# EAGLE design Modellfinder (EAGLE 7.6.0)
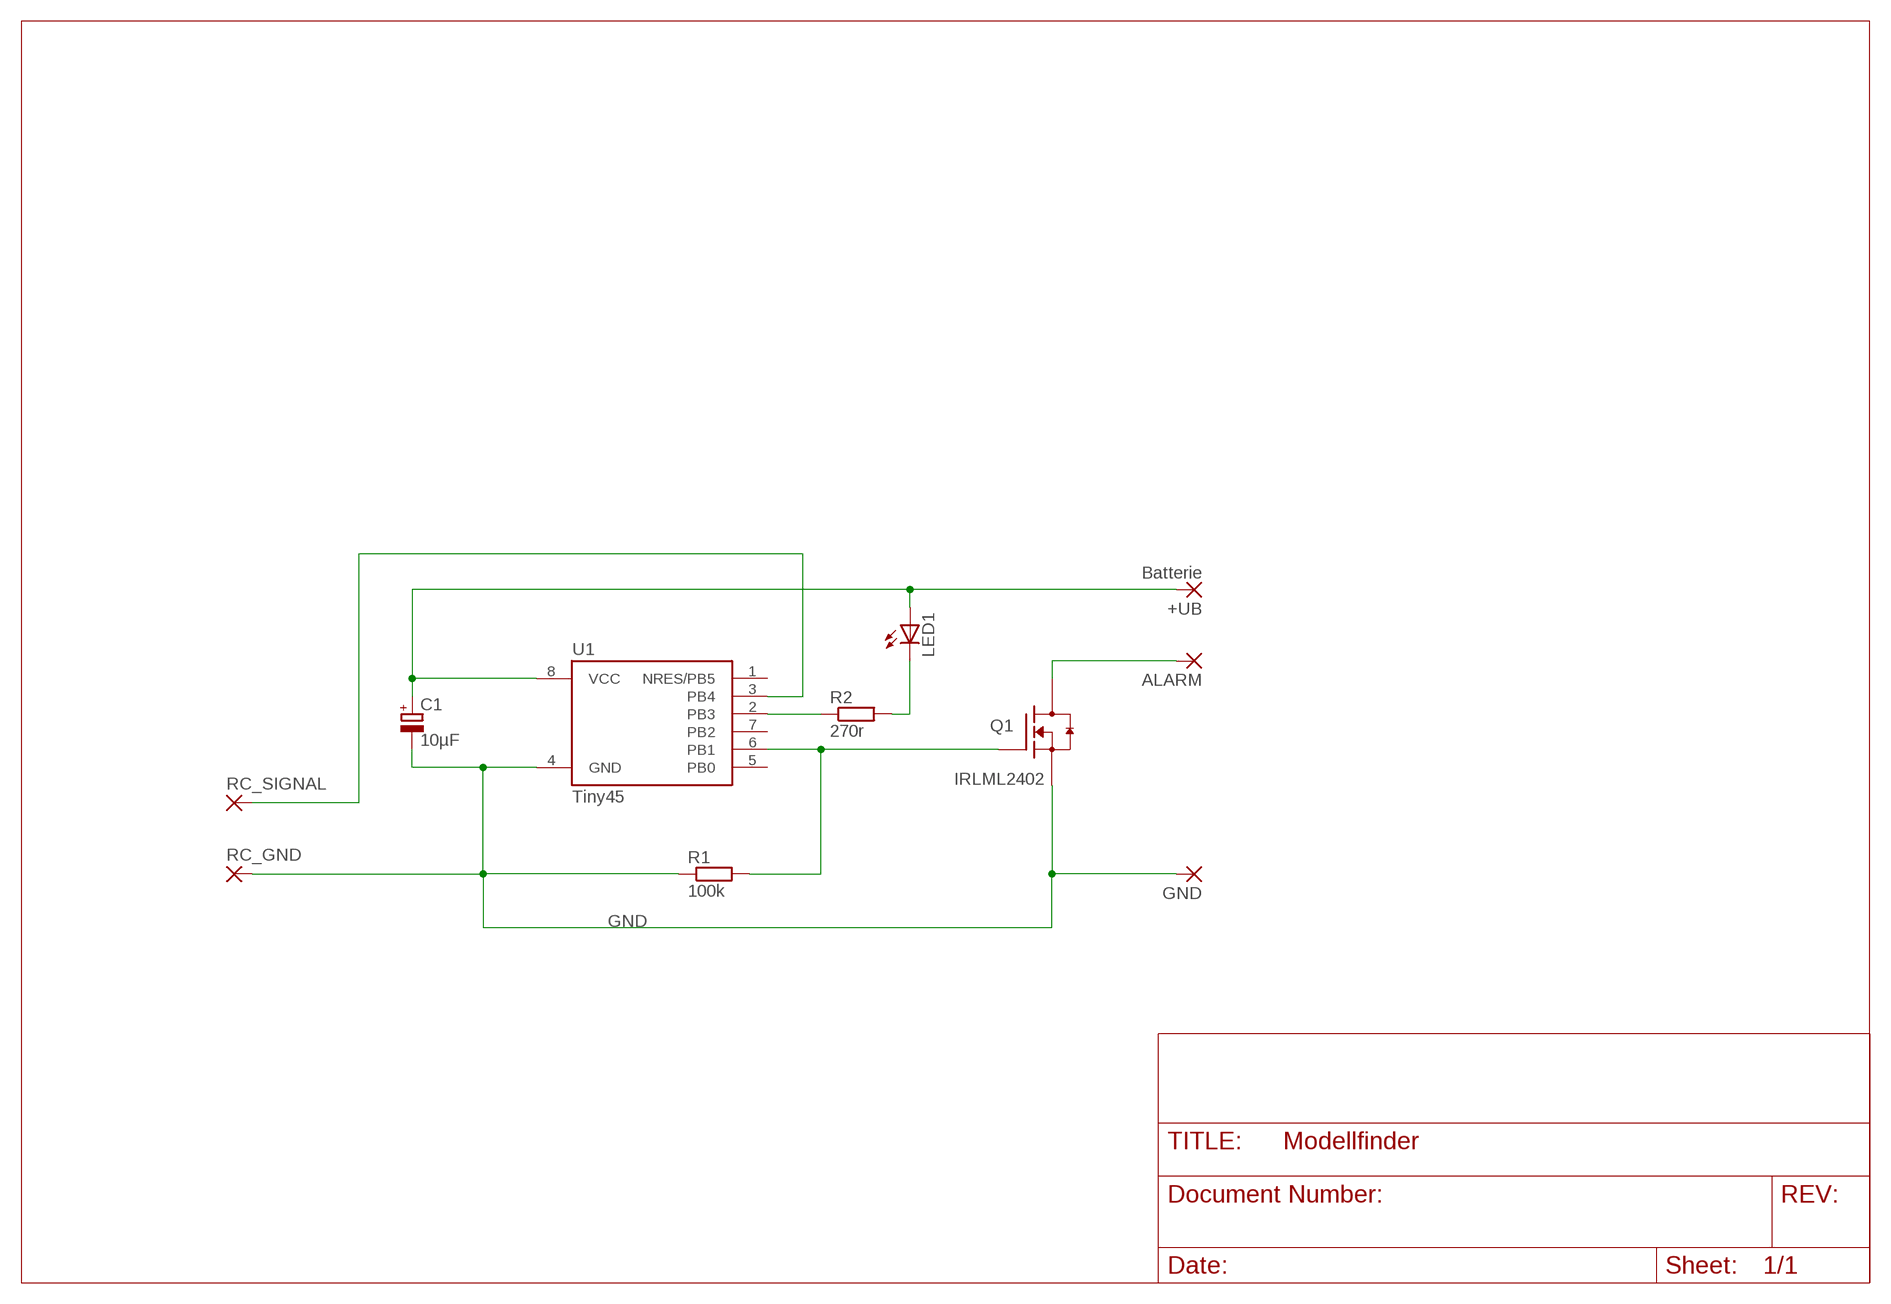
[diagram p0: schematic, sheet 1]

## Parts
+UB  Batterie  SMD2  [SMD1,27-2,54]
ALARM  SMD2  [SMD1,27-2,54]
C1  10µF  CPOL-EU085CS-1AR  [085CS_1AR]
GND  SMD2  [SMD1,27-2,54]
LED1  LEDSML0805  [SML0805]
Q1  IRLML2402  MOSFET-NCH_SOT-23  [SOT95P280X135-3N]
R1  100k  R-EU_M1206  [M1206]
R2  270r  R-EU_M1206  [M1206]
RC_GND  SMD2  [SMD1,27-2,54]
RC_SIGNAL  SMD2  [SMD1,27-2,54]
U1  Tiny45  ATTINY85-S  [SOIC8_EIAJ_208MIL]

## Nets
GND: C1.- GND.1(P) Q1.2(S) R1.1 RC_GND.1(P) U1.4(GND)
N$1: Q1.1(G) R1.2 U1.6(PB1)
N$2: LED1.C R2.2
N$3: +UB.1(P) C1.+ LED1.A U1.8(VCC)
N$4: ALARM.1(P) Q1.3(D)
N$5: RC_SIGNAL.1(P) U1.3(PB4)
N$6: R2.1 U1.2(PB3)
Unconnected: U1.1(NRES/PB5) U1.5(PB0) U1.7(PB2)

## Library data of the parts
+UB ALARM GND RC_GND RC_SIGNAL = wirepad:SMD2: SMD PAD
C1 = rcl:CPOL-EU: POLARIZED CAPACITOR, European symbol
LED1 = led:LED: LED OSRAM: - CHIPLED LG R971, LG N971, LY N971, LG Q971, LY Q971, LO R971, LY R971 LH N974, LH R974 LS Q976, LO Q976, LY Q976 LO Q996 - Hyper CHIPLED LW Q18S LB Q993, LB Q99A, LB R99A - SideLED LS A670, LO A670, LY A670, LG A670, LP A670 LB A673, LV A673, LT A673, LW A673 LH A674 LY A675 LS A676, LA A676, LO A676, LY A676, LW A676 LS A679, LY A679, LG A679 - Hyper Micro SIDELED® LS Y876, LA Y876, LO Y876, LY Y876 LT Y87S - SmartLED LW L88C, LW L88S LB L89C, LB L89S, LG L890 LS L89K, LO L89K, LY L89K LS L896, LA L896, LO L896, LY L896 - TOPLED LS T670, LO T670, LY T670, LG T670, LP T670 LSG T670, LSP T670, LSY T670, LOP T670, LYG T670 LG T671, LOG T671, LSG T671 LB T673, LV T673, LT T673, LW T673 LH T674 LS T676, LA T676, LO T676, LY T676, LB T676, LH T676, LSB T676, LW T676 LB T67C, LV T67C, LT T67C, LS T67K, LO T67K, LY T67K, LW E67C LS E67B, LA E67B, LO E67B, LY E67B, LB E67C, LV E67C, LT E67C LW T67C LS T679, LY T679, LG T679 LS T770, LO T770, LY T770, LG T770, LP T770 LB T773, LV T773, LT T773, LW T773 LH T774 LS E675, LA E675, LY E675, LS T675 LS T776, LA T776, LO T776, LY T776, LB T776 LHGB T686 LT T68C, LB T68C - Hyper Mini TOPLED® LB M676 - Mini TOPLED Santana® LG M470 LS M47K, LO M47K, LY M47K Source: http://www.osram.convergy.de LUXEON: - LUMILED® LXK2-PW12-R00, LXK2-PW12-S00, LXK2-PW14-U00, LXK2-PW14-V00 LXK2-PM12-R00, LXK2-PM12-S00, LXK2-PM14-U00 LXK2-PE12-Q00, LXK2-PE12-R00, LXK2-PE12-S00, LXK2-PE14-T00, LXK2-PE14-U00 LXK2-PB12-K00, LXK2-PB12-L00, LXK2-PB12-M00, LXK2-PB14-N00, LXK2-PB14-P00, LXK2-PB14-Q00 LXK2-PR12-L00, LXK2-PR12-M00, LXK2-PR14-Q00, LXK2-PR14-R00 LXK2-PD12-Q00, LXK2-PD12-R00, LXK2-PD12-S00 LXK2-PH12-R00, LXK2-PH12-S00 LXK2-PL12-P00, LXK2-PL12-Q00, LXK2-PL12-R00 Source: www.luxeon.com KINGBRIGHT: KA-3528ASYC Source: www.kingbright.com
Q1 = ipc-7351-transistor:MOSFET-NCH_
R1 R2 = rcl:R-EU_: RESISTOR, European symbol
U1 = _hhn_attiny25_45_85:ATTINY85*: ATMEL ATtiny 85 Packages: P = PDIP 08 30mil S = SOIC 08 EIAJ 208mil Technologies Note: for complete ordering code (temp. range, finish, tape&reel etc.) see www.atmel.com • Supply Voltage: V = (1.8…5.5)V | [blank] = (2.7…5.5)V • Speed: 10 = 10 MHz | 20 = 20 MHz Author: Dipl.-Ing. FH Rainer Bayer HHN Hochschule Heilbronn (Heilbronn University), rainer.bayer@hs-heilbronn.de Ingenieurbüro ing-rb, mail@ing-rb.de

## Net classes
0 default: clearance 0.205 mm

## Board
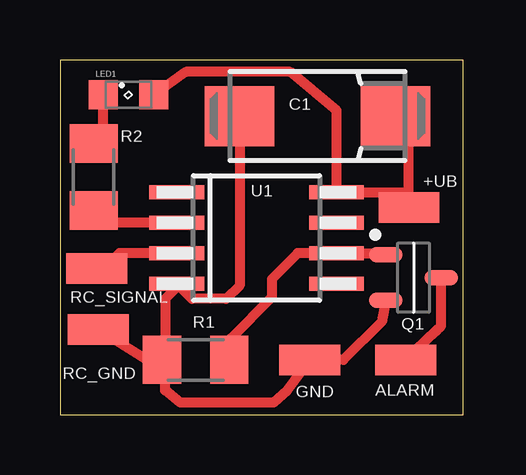
[diagram p1: board, top side]

Size 16.81 x 14.78 mm. Coordinates in mm from the lower left corner, seen from the top.
Outline: 0,0 16.81,0 16.81,14.78 0,14.78 0,0
Copper layers (1*16): Top 0.035mm / dielectric 1.5mm / Bottom 0.035mm
Design rules "Modellfinder": minimum track width 10mil, minimum drill 24mil, track to track 0.205mm, track to pad 0.205mm, pad to pad 0.205mm, via to via 0.205mm, smd to smd 8mil, copper to edge 40mil, drill to drill 8mil, minimum pad ring 10mil, minimum via ring 8mil, stop-mask expansion 4mil, vias tented up to drill 0mil, thermal gap 10mil

### Footprints (pad centres in the part's own frame; a part is rotated, then mirrored left to right if it is on the bottom)
SMD1,27-2,54 = smd 1.27 x 2.54: 1 0,0
085CS_1AR = smd 2.9 x 2.5: + 3.25,0; - -3.25,0
SML0805 = smd 1.2 x 1.2: A 1.05,0; C -1.05,0
SOT95P280X135-3N = smd 1.4 x 0.65: 1 -1.15,0.95; 2 -1.15,-0.95; 3 1.15,0
M1206 = smd 1.6 x 2: 1 -1.4,0; 2 1.4,0
SOIC8_EIAJ_208MIL = smd 0.6 x 2.286: 1 -1.905,-3.33; 2 -0.635,-3.33; 3 0.635,-3.33; 4 1.905,-3.33; 5 1.905,3.33; 6 0.635,3.33; 7 -0.635,3.33; 8 -1.905,3.33

### Placement (x,y rotation side)
+UB  14.54,8.64 90 top
ALARM  14.41,2.29 90 top
C1  10.73,12.45 0 top
GND  10.41,2.29 90 top
LED1  2.86,13.34 0 top
Q1  14.73,5.71 0 top
R1  5.65,2.29 0 top
R2  1.4,9.91 90 top
RC_GND  1.59,3.56 90 top
RC_SIGNAL  1.52,6.1 90 top
U1  8.19,7.37 270 top

### Tracks (layer width: path | path; a pad name or v marks a point on that pad's centre or on a via)
GND
  Top 0.406: C1.- 7.48,5.39 6.92,4.83 5.5,4.83 U1.4 4.86,5.31 4.38,4.83 4.38,2.42 R1.1 | R1.1 3.62,2.29 RC_GND.1 | R1.1 4.38,2.16 4.38,1.02 5.02,0.51 8.89,0.51 9.46,1.02 GND.1 11.81,2.29 13.4,3.88 Q1.2
N$1
  Top 0.406: R1.2 7.11,2.35 7.11,3.17 8.83,4.89 8.83,5.65 9.91,6.73 U1.6 13.58,6.73 Q1.1
N$2
  Top 0.406: R2.2 1.81,11.31 LED1.C
N$3
  Top 0.406: +UB.1 14.54,9.14 | 14.54,9.14 14.54,11.89 C1.+ | 14.54,9.14 14.41,9.27 U1.8 11.52,12.67 9.59,14.29 5.24,14.29 LED1.A
N$4
  Top 0.406: ALARM.1 15.68,3.49 15.88,3.69 Q1.3
N$5
  Top 0.406: U1.3 2.48,6.73 1.84,6.1 RC_SIGNAL.1
N$6
  Top 0.406: U1.2 1.97,8 R2.1

### Text on the board
tDocu: + | 1